# EAGLE design firefan (EAGLE 6.5.0)
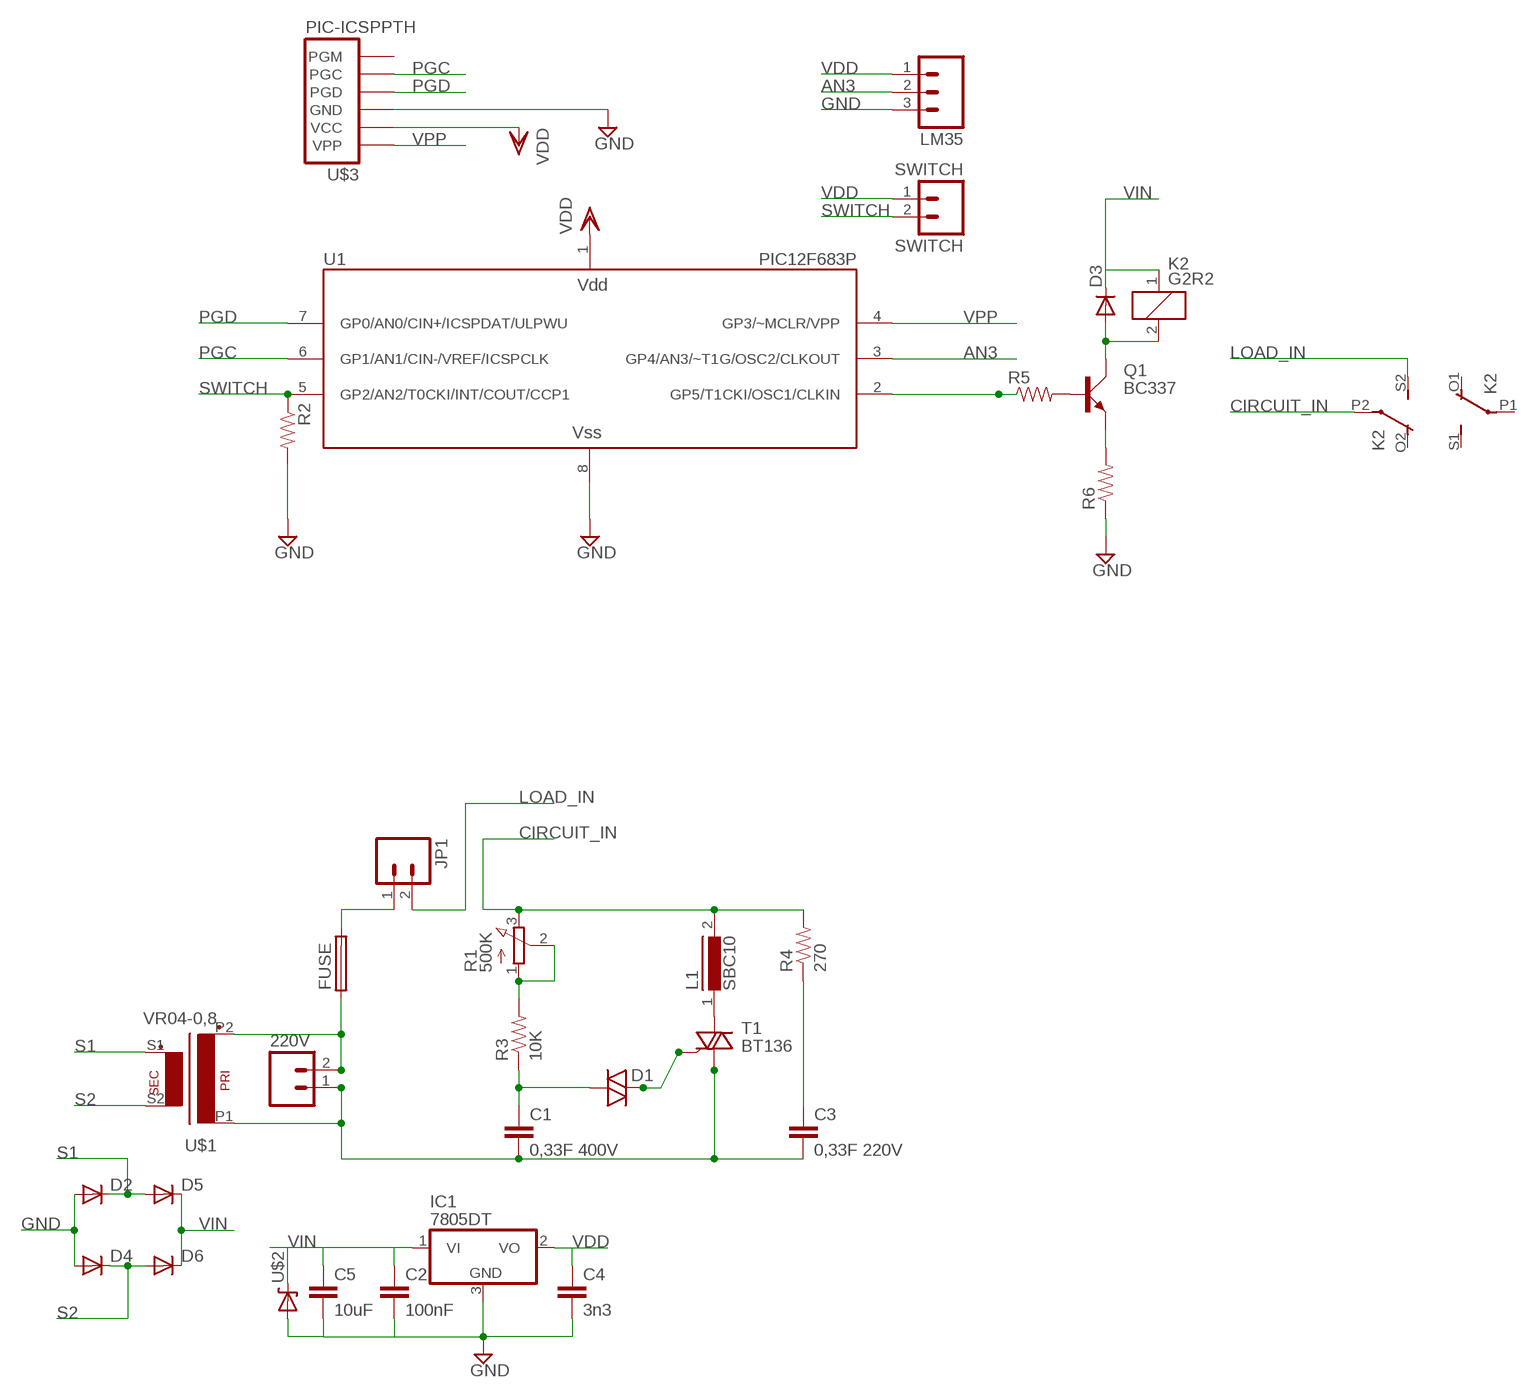
[diagram p0: schematic, sheet 1]

## Parts
220V  M023.5MM-NO_SILK  [SCREWTERMINAL-3.5MM-2-NS]
C1  0,33F 400V  CAPPTH1  [CAP-PTH-5MM]
C2  100nF  CAPPTH1  [CAP-PTH-5MM]
C3  0,33F 220V  CAPPTH1  [CAP-PTH-5MM]
C4  3n3  CAPPTH1  [CAP-PTH-5MM]
C5  10uF  CAPPTH1  [CAP-PTH-5MM]
D1  DIAC-DO35-10  [DO35-10]
D2  1N4004  [DO41-10]
D3  1N4004  [DO41-10]
D4  1N4004  [DO41-10]
D5  1N4004  [DO41-10]
D6  1N4004  [DO41-10]
FUSE  SH22,5A  [SH22,5A]
IC1  7805DT  [TO252]
JP1  M023.5MM-NO_SILK  [SCREWTERMINAL-3.5MM-2-NS]
K2  G2R2  [G2R2]
L1  SBC10  [SBC10]
LM35  M03LONGPADS  [1X03_LONGPADS]
Q1  BC337  [SOT54A]
R1  500K  3RP/1610N  [3RP/1610N]
R2  RESISTORPTH-1/4W  [AXIAL-0.4]
R3  10K  RESISTORPTH-1/2W  [AXIAL-0.5]
R4  270  RESISTORPTH-1/2W  [AXIAL-0.5]
R5  RESISTORPTH-1/4W  [AXIAL-0.4]
R6  RESISTORPTH-1/4W  [AXIAL-0.4]
SWITCH  SWITCH  M023.5MM-NO_SILK  [SCREWTERMINAL-3.5MM-2-NS]
T1  BT136  [TO220AB]
U1  PIC12F683P  [DIP-8]
U$1  VR04-0,8  [VR04-0,8]
U$2  DIODE-ZENERPTH  [DIODE-ZENER]
U$3  PIC-ICSPPTH  [MOLEX-1X6]

## Nets
AN3: LM35.2 U1.3(GP4/AN3/~T1G/OSC2/CLKOUT)
CIRCUIT_IN: K2.P2(3:P) L1.2 R1.3(E) R4.P$2
GND: C2.2 C4.2 C5.2 D2.A D4.A IC1.3(GND) LM35.3 R2.P$2 R6.P$1 U1.8(VSS) U$2.P$2(A) U$3.3(GND)
LOAD_IN: JP1.2 K2.S2(3:S)
N$1: FUSE.2 JP1.1
N$2: D1.C T1.3(G)
N$3: R1.1(A) R1.2(S) R3.P$2
N$4: L1.1 T1.2(A2)
N$5: C1.1 D1.A R3.P$1
N$6: C3.1 R4.P$1
N$7: 220V.1 C1.2 C3.2 T1.1(A1) U$1.P1
N$8: 220V.2 FUSE.1 U$1.P2
N$9: Q1.B R5.P$2
N$10: Q1.E R6.P$2
N$11: D3.A K2.2 Q1.C
PGC: U1.6(GP1/AN1/CIN-/VREF/ICSPCLK) U$3.5(PGC)
PGD: U1.7(GP0/AN0/CIN+/ICSPDAT/ULPWU) U$3.4(PGD)
RELAIS: R5.P$1 U1.2(GP5/T1CKI/OSC1/CLKIN)
S1: D2.C D5.A U$1.S1(S3)
S2: D4.C D6.A U$1.S2(S4)
SWITCH: R2.P$1 SWITCH.2 U1.5(GP2/AN2/T0CKI/INT/COUT/CCP1)
VDD: C4.1 IC1.2(VO) LM35.1 SWITCH.1 U1.1(VDD) U$3.2(VCC)
VIN: C2.1 C5.1 D3.C D5.C D6.C IC1.1(VI) K2.1 U$2.P$1(C)
VPP: U1.4(GP3/~MCLR/VPP) U$3.1(VPP)
Unconnected: K2.O1(2:O) K2.O2(3:O) K2.P1(2:P) K2.S1(2:S) U$3.6(PGM)

## Library data of the parts
220V JP1 SWITCH = SparkFun-Connectors:M02: Header 2 Standard 2-pin 0.1" header. Use with straight break away headers (SKU : PRT-00116), right angle break away headers (PRT-00553), swiss pins (PRT-00743), machine pins (PRT-00117), and female headers (PRT-00115). Molex polarized connector foot print use with SKU : PRT-08233 with associated crimp pins and housings.
C1-C5 = SparkFun-Capacitors:CAP: Capacitor Standard 0603 ceramic capacitor, and 0.1" leaded capacitor.
D1 = diode:DIAC-: DIAC
D2-D6 = adafruit:1N4004: DIODE General purpose 1N400x type rectifier (With bigger pads) http://www.ladyada.net/library/pcb/eaglelibrary.html
FUSE = fuse:SH22,5A: FUSE HOLDER grid 22,5mm, isolated cap OGN0031 8201, Schurter (Buerklin); MPN: 0031.7701.11; OC_FARNELL: unknown; OC_NEWARK: 04F1224
IC1 = adafruit:78*: Positive VOLTAGE REGULATOR Added bigger pads to the TO-92 package
K2 = relay:G2R2: RELAY 2 x switch, Omron; MF: OMRON COMPONENTS USA; MPN: G2R-2-DC6; OC_FARNELL: unknown; OC_NEWARK: 89C5317
L1 = inductors:SBC10: INDUCTOR
LM35 = SparkFun-Connectors:M03: Header 3 Standard 3-pin 0.1" header. Use with straight break away headers (SKU : PRT-00116), right angle break away headers (PRT-00553), swiss pins (PRT-00743), machine pins (PRT-00117), and female headers (PRT-00115). Molex polarized connector foot print use with SKU : PRT-08232 with associated crimp pins and housings.
Q1 = transistor-small-signal:BC337: NPN TRANSISTOR
R1 = pot:3RP/1610N: 16mm Potentiometer one level Source: http://www.alphapotentiometers.net/html/16mm_pot_2.html
R2-R6 = SparkFun-Resistors:RESISTOR: Resistor Basic schematic elements and footprints for 0603, 1206, and PTH resistors.
T1 = triac:BT136: Triac BT136 series E sensitive gate Source: http://www.nxp.com/acrobat_download/datasheets/BT136_SERIES_E_2.pdf
U1 = microchip_10f:PIC12F683: Microchip PIC12F683 8-pin 8-bit Flash microcontroller with nanoWatt Technology 2048 words program memory, 128 bytes RAM, 256 bytes EEPROM 6 I/O, 4 10-bit A/D, 1 comparator, 2 8-bit timers, 1 16-bit timer, ULPWU
U$1 = trafo:VR04-0,8
U$2 = SparkFun-DiscreteSemi:DIODE-ZENER: Zener Diode Production Part - 8199 3.4V Zener Voltage
U$3 = SparkFun-Connectors:PIC-ICSP: ISCP Programming connector for UAV, UBW Kit, etc.

## Board
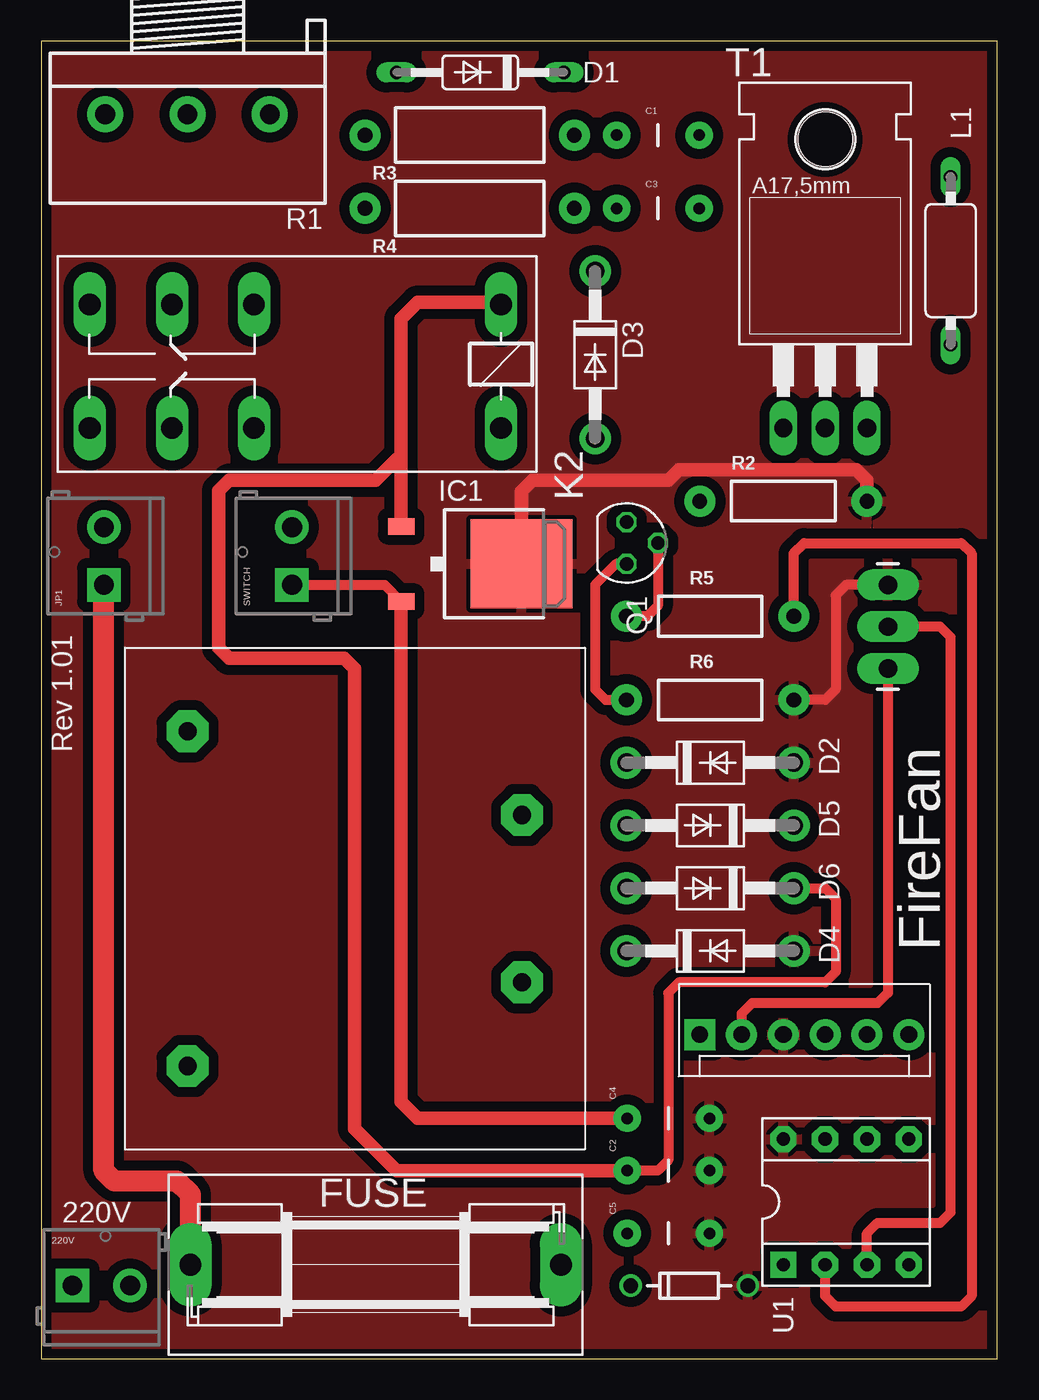
[diagram p1: board, top side]
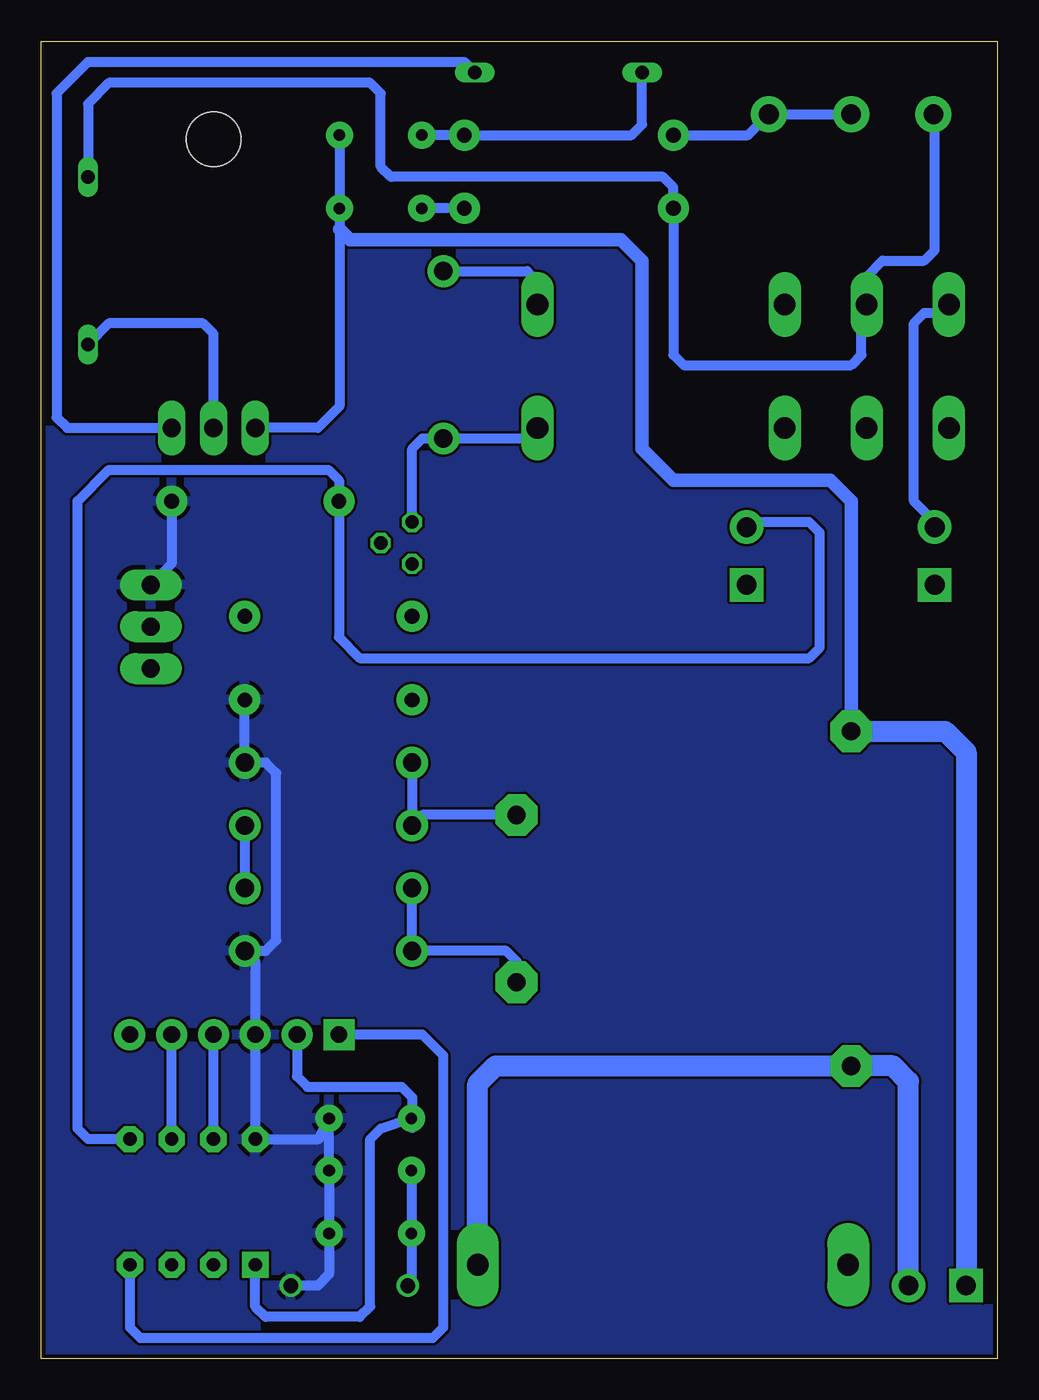
[diagram p2: board, bottom side, seen from below]

Size 58.09 x 80 mm. Coordinates in mm from the lower left corner, seen from the top.
Outline: 0,0 58.09,0 58.09,80 0,80 0,0
Copper layers (1*2*15*16): Top 0.035mm / dielectric 0.2mm / layer 2 0.0175mm / dielectric 1.1mm / layer 15 0.0175mm / dielectric 0.2mm / Bottom 0.035mm
Design rules "SeeedStudio_DRU_no_angle_20130527": minimum track width 6mil, minimum drill 12mil, track to track 6mil, track to pad 6mil, pad to pad 6mil, via to via 6mil, smd to smd 0mil, copper to edge 10mil, drill to drill 10mil, minimum pad ring 6mil, minimum via ring 6mil, stop-mask expansion 2mil, vias tented up to drill 25mil, thermal gap 10mil

### Footprints (pad centres in the part's own frame; a part is rotated, then mirrored left to right if it is on the bottom)
SCREWTERMINAL-3.5MM-2-NS = drill 1.2 pad 2.032 square: 1 0,0 | drill 1.2 pad 2.032: 2 3.5,0
CAP-PTH-5MM = drill 0.7 pad 1.651: 1 -2.5,0; 2 2.5,0
DO35-10 = drill 0.813 long: A 5.08,0; C -5.08,0
DO41-10 = drill 1.118 pad 1.93: A 5.08,0; C -5.08,0
SH22,5A = drill 1.321 pad 2.54 long: 1 -11.252,0; 2 11.252,0
TO252 = smd 1 x 1.6: 1 -2.28,-4.8; 2 2.28,-4.8 | smd 5.4 x 6.2: 3 0,2.5
G2R2 = drill 1.321 long: 1 -2.54,-3.683; 2 -2.54,3.81; O1 12.471,3.81; O2 12.471,-3.683; P1 17.45,3.81; P2 17.45,-3.683; S1 22.454,3.81; S2 22.454,-3.683
SBC10 = drill 0.813 long: 1 -5.08,0; 2 5.08,0
1X03_LONGPADS = drill 1.118 pad 1.88 long: 1 0,0; 2 2.54,0; 3 5.08,0
SOT54A = drill 0.813 octagon: B 0,1.905; C -1.27,0; E 1.27,0
3RP/1610N = drill 1.2 pad 2.184: 1 -5,0; 2 0,0; 3 5,0
AXIAL-0.4 = drill 0.9 pad 1.88: P$1 -5.08,0; P$2 5.08,0
AXIAL-0.5 = drill 0.9 pad 1.88: P$1 -6.35,0; P$2 6.35,0
TO220AB = drill 1.118 long: 1 -2.54,-6.35; 2 0,-6.35; 3 2.54,-6.35 | hole 3.302: 0,11.176
DIP-8 = drill 0.813 pad 1.6 square: 1 -3.81,3.81 | drill 0.813 pad 1.6 octagon: 2 -3.81,1.27; 3 -3.81,-1.27; 4 -3.81,-3.81; 5 3.81,-3.81; 6 3.81,-1.27; 7 3.81,1.27; 8 3.81,3.81
VR04-0,8 = drill 1.1 pad 2.54 octagon: P1 -10.16,-10.16; P2 10.16,-10.16; S1 -5.08,10.16; S2 5.08,10.16
DIODE-ZENER = drill 0.9: P$1 -3.556,0; P$2 3.556,0
MOLEX-1X6 = drill 1.016 pad 1.88 square: 1 0,0 | drill 1.016 pad 1.88: 2 2.54,0; 3 5.08,0; 4 7.62,0; 5 10.16,0; 6 12.7,0

### Placement (x,y rotation side)
220V  1.91,4.45 0 top
C1  37.47,74.3 0 top
C2  38.1,11.43 0 top
C3  37.47,69.85 0 top
C4  38.1,14.61 0 top
C5  38.1,7.62 0 top
D1  26.67,78.11 180 top
D2  40.64,36.2 0 top
D3  33.66,60.96 270 top
D4  40.64,24.77 0 top
D5  40.64,32.38 180 top
D6  40.64,28.57 180 top
FUSE  20.32,5.71 180 top
IC1  26.67,48.26 270 top
JP1  3.81,46.99 90 top
K2  25.4,60.33 180 top
L1  55.24,66.67 90 top
LM35  51.44,41.91 90 top
Q1  35.56,49.53 270 top
R1  8.89,75.56 180 top
R2  45.09,52.07 0 top
R3  26.04,74.3 180 top
R4  26.04,69.85 180 top
R5  40.64,45.09 180 top
R6  40.64,40.01 180 top
SWITCH  15.24,46.99 90 top
T1  47.62,62.87 0 top
U1  48.9,9.53 90 top
U$1  19.05,27.94 270 top
U$2  39.37,4.45 0 top
U$3  40.01,19.68 0 top

### Tracks (layer width: path | path; a pad name or v marks a point on that pad's centre or on a via)
AN3
  Top 0.61: U1.3 50.16,7.62 50.8,8.26 54.61,8.26 55.24,8.89 55.24,43.81 54.61,44.45 LM35.2
CIRCUIT_IN
  Bottom 0.61: R1.3 3.81,75.48 3.81,67.31 4.45,66.67 6.99,66.67 7.95,65.71 K2.P2 8.26,63.7 8.26,60.96 8.89,60.33 19.05,60.33 19.68,60.96 R4.P$2 19.68,71.12 20.32,71.75 36.83,71.75 37.47,72.39 37.47,76.83 38.1,77.47 53.98,77.47 55.24,76.2 L1.2
GND
  Top 0.61: LM35.3 48.9,46.99 48.26,46.35 48.26,40.64 47.62,40.01 R6.P$1
  Top 0.813: IC1.3 29.17,52.66 29.84,53.34 38.1,53.34 38.73,53.98 49.53,53.98 50.16,53.34 R2.P$2
  Bottom 0.61: R2.P$2 50.16,48.26 LM35.3 | R6.P$1 D2.A 44.45,36.2 43.81,35.56 43.81,25.4 44.45,24.77 D4.A 45.09,24.13 U$3.3 U1.8 41.23,13.34 C4.2 C2.2 C5.2 40.6,5.12 41.27,4.45 U$2.P$2
  pour Top (isolate 0.61): 0,80.01 58.42,80.01 58.42,0 0,0
  pour Bottom: 0,80.01 57.78,80.01 57.78,0 0,0
LOAD_IN
  Bottom 0.61: JP1.2 3.81,50.8 5.08,52.07 5.08,62.87 4.45,63.5 3.45,63.5 K2.S2
N$1
  Top 1.27: FUSE.2 9.07,9.98 8.26,10.79 4.45,10.79 3.81,11.43 JP1.1
N$2
  Bottom 0.61: T1.3 56.52,56.52 57.15,57.15 57.15,76.83 55.24,78.74 32.38,78.74 D1.C
N$3
  Bottom 0.61: R3.P$2 15.16,74.3 R1.1 R1.2
N$4
  Bottom 0.61: T1.2 47.62,62.23 48.26,62.87 53.98,62.87 L1.1
N$5
  Bottom 0.61: C1.1 R3.P$1 22.23,74.3 21.59,74.93 D1.A
N$6
  Bottom 0.61: R4.P$1 C3.1
N$7
  Bottom 0.61: C1.2 C3.2 | C3.2 39.97,69.25 40.01,69.22 40.01,69.81 C3.2 | C3.2 39.97,68.58 39.97,57.83 41.27,56.52 T1.1
  Bottom 0.813: U$1.P1 8.89,52.07 10.16,53.34 19.68,53.34 21.59,55.24 21.59,66.67 22.86,67.94 39.33,67.94 39.97,68.58
  Bottom 1.27: U$1.P1 3.17,38.1 1.91,36.83 220V.1
N$8
  Bottom 1.27: 220V.2 5.41,16.84 6.35,17.78 U$1.P2 30.48,17.78 31.57,16.69 FUSE.1
N$9
  Top 0.61: Q1.B 37.47,45.72 36.83,45.09 R5.P$2
N$10
  Top 0.61: Q1.E 34.92,48.26 33.66,46.99 33.66,40.64 34.29,40.01 R6.P$2
N$11
  Bottom 0.61: K2.2 28.57,55.88 D3.A 34.92,55.88 35.56,55.24 Q1.C
PGC
  Bottom 0.61: U1.6 U$3.5
PGD
  Bottom 0.61: U1.7 U$3.4
RELAIS
  Top 0.61: R5.P$1 45.72,48.9 46.35,49.53 55.88,49.53 56.52,48.9 56.52,3.81 55.88,3.17 48.26,3.17 47.62,3.81 U1.2
S1
  Bottom 0.61: U$1.S1 34.92,33.02 D5.A D2.C
S2
  Bottom 0.61: U$1.S2 29.21,24.13 29.84,24.77 D4.C 35.56,27.94 34.92,28.57 D6.A
SWITCH
  Bottom 0.61: SWITCH.2 14.93,50.8 11.43,50.8 10.79,50.16 10.79,43.18 11.43,42.55 38.73,42.55 40.01,43.81 R2.P$1 40.01,53.34 40.64,53.98 53.98,53.98 55.88,52.07 55.88,13.97 55.24,13.34 U1.5
VDD
  Top 0.61: SWITCH.1 20.86,46.99 IC1.2 | LM35.1 51.44,22.23 50.8,21.59 43.18,21.59 42.55,20.95 U$3.2
  Top 0.813: IC1.2 21.87,15.6 22.86,14.61 C4.1
  Bottom 0.61: U$3.2 42.55,17.14 41.91,16.51 36.2,16.51 35.56,15.88 35.56,14.01 C4.1 37.47,13.97 38.1,13.34 38.1,3.17 38.73,2.54 44.45,2.54 45.09,3.17 U1.1
VIN
  Top 0.61: D6.C 47.62,28.57 48.26,27.94 48.26,23.5 47.62,22.86 38.73,22.86 38.1,22.23 38.1,12.06 37.47,11.43 C2.1
  Top 0.813: IC1.1 21.87,54.61 | 21.87,54.61 21.87,63.15 22.86,64.14 27.81,64.14 K2.1 | C2.1 21.59,11.43 19.05,13.97 19.05,41.91 18.41,42.55 11.43,42.55 10.79,43.18 10.79,52.7 11.43,53.34 20.32,53.34 21.59,54.61 21.87,54.61
  Bottom 0.61: D3.C 28.57,66.04 27.94,65.41 K2.1 | U$2.P$1 35.6,4.87 C5.1 C2.1 | D5.C D6.C
VPP
  Bottom 0.61: U1.4 52.7,1.91 52.07,1.27 34.29,1.27 33.66,1.91 33.66,18.41 34.92,19.68 U$3.1

### Text on the board
tNames: Rev 1.01 | FireFan | 220V